# EAGLE schematic CH585M-R1 (EAGLE 9.6.2)
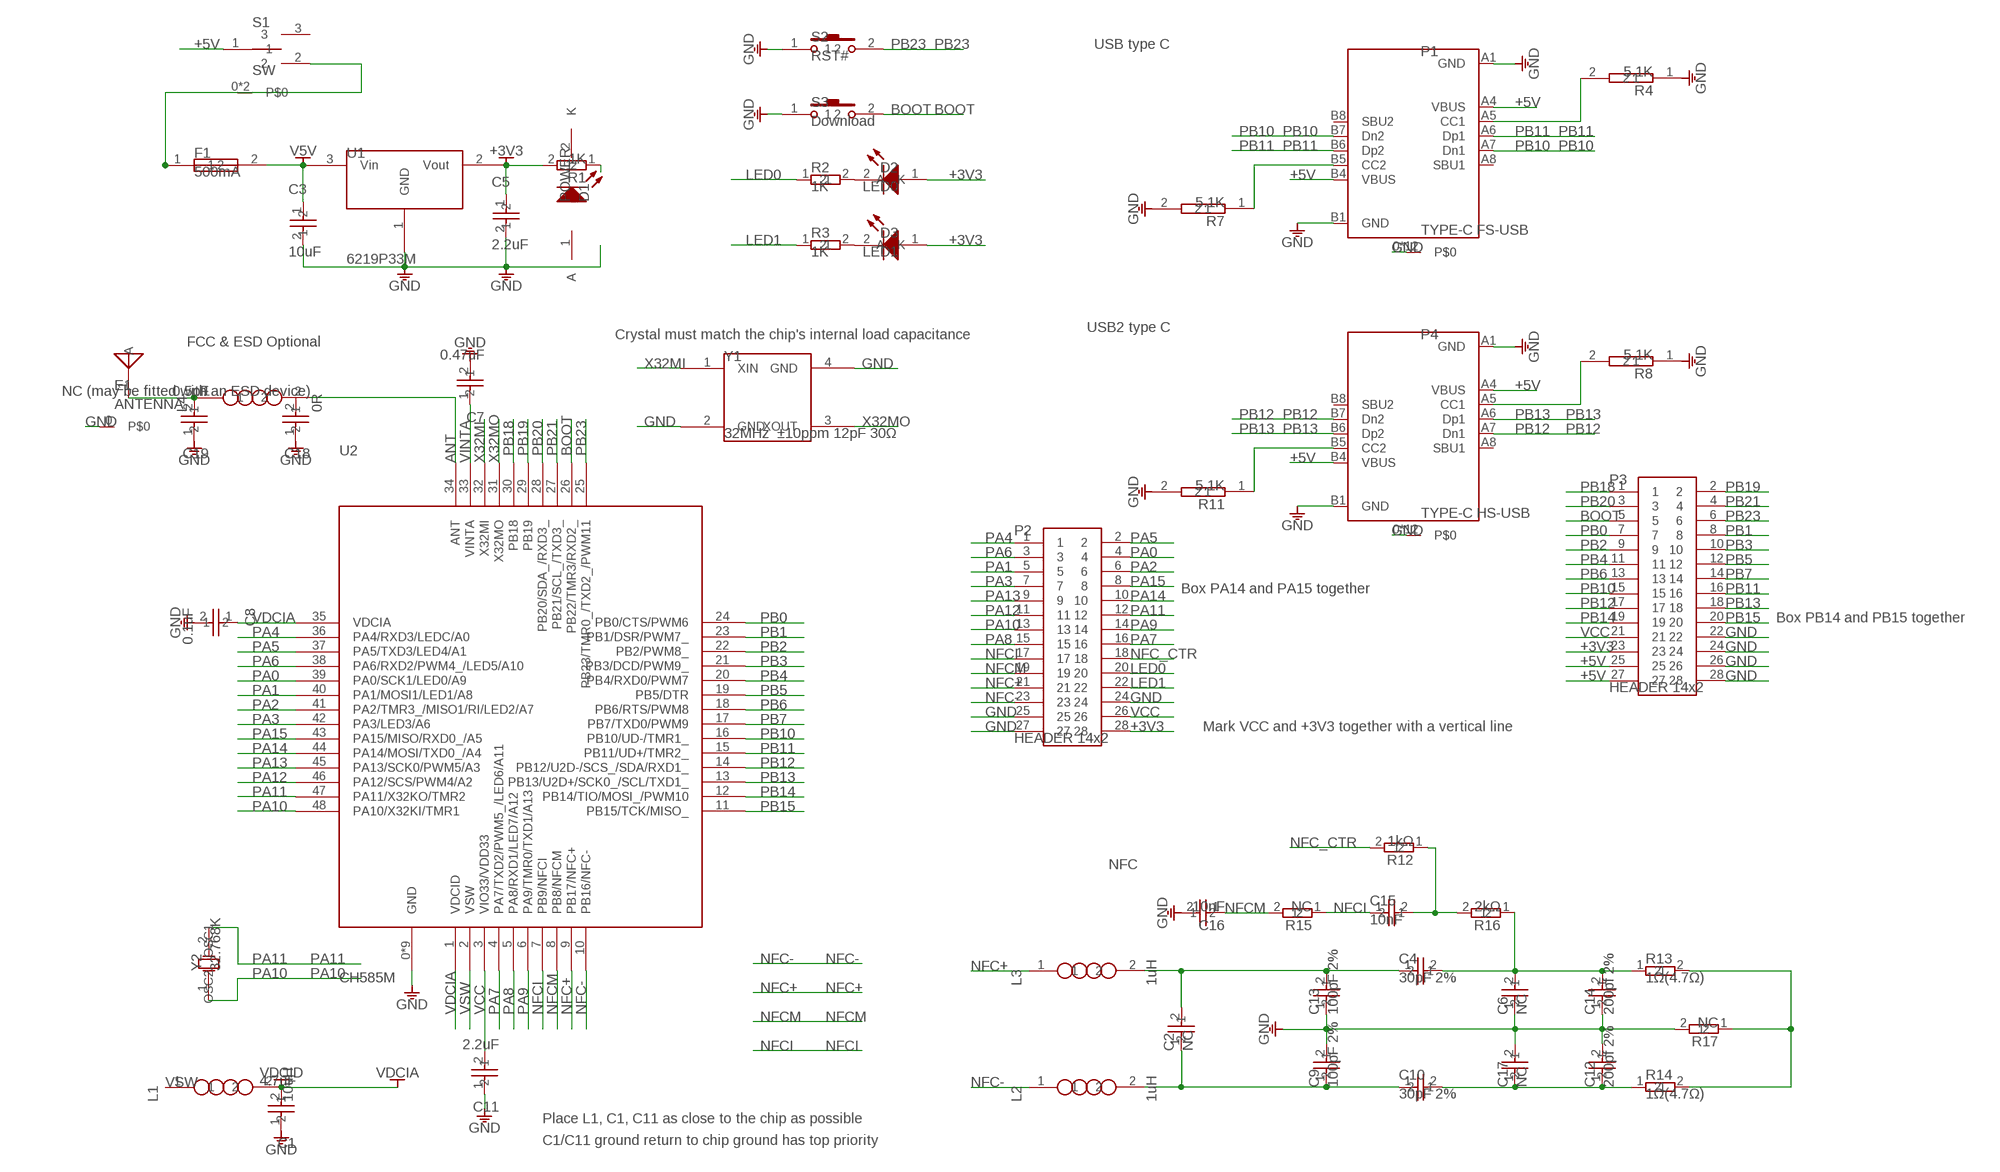
[diagram p0: schematic, sheet 1]

## Parts
C1  4.7uF  CAP-0402_C_8b34ab  [0402_C_8b34ab]
C2  NC  CAP_faf0ea-0402_C  [0402_C]
C3  10uF  CAP-0603_C  [0603_C]
C4  30pF 2%  CAP_faf0ea-0402_C_a5b067  [0402_C_a5b067]
C5  2.2uF  CAP-0402_C  [0402_C]
C6  NC  CAP_faf0ea-0402_C_a5b067  [0402_C_a5b067]
C7  0.47uF  CAP-0402_C  [0402_C]
C8  0.1uF  CAP-0402_C_ea6f3d  [0402_C_ea6f3d]
C9  100pF 2%  CAP_faf0ea-0402_C  [0402_C]
C10  30pF 2%  CAP_faf0ea-0402_C_a5b067  [0402_C_a5b067]
C11  2.2uF  CAP-0402_C_a5b067  [0402_C_a5b067]
C12  200pf 2%  CAP_faf0ea-0402_C_8b34ab  [0402_C_8b34ab]
C13  100pF 2%  CAP_faf0ea-0402_C  [0402_C]
C14  200pf 2%  CAP_faf0ea-0402_C_a5b067  [0402_C_a5b067]
C15  10nF  CAP_faf0ea-0402_C_a5b067  [0402_C_a5b067]
C16  10nF  CAP_faf0ea-0402_C_8b34ab  [0402_C_8b34ab]
C17  NC  CAP_faf0ea-0402_C_8b34ab  [0402_C_8b34ab]
C18  NC (may be fitted with an ESD device)  CAP-0402_C  [0402_C]
C19  0.5pF  CAP-0402_C  [0402_C]
D1  POWER  LED0-0603+  [0603+]
D2  LED0  LED0_27b5ee-0603+  [0603+]
D3  LED1  LED0_27b5ee-0603+  [0603+]
E1  ANTENNA  ANTENNA-ANT-F-1-2.4G-1.6mmFR4  [ANT-F-1-2.4G-1.6mmFR4]
F1  500mA  FUSE1-0603_8bd959  [0603_8bd959]
L1  10uH  INDUCTOR-SMD_2x2mm  [SMD_2x2mm]
L2  1uH  INDUCTOR-0603  [0603]
L3  1uH  INDUCTOR-0603  [0603]
L4  0R  INDUCTOR-SMD_2x2mm  [SMD_2x2mm]
P1  TYPE-C FS-USB  TYPE-C-Receptacle-2.0-TYPE-C-Receptacle-2.0  [TYPE-C-Receptacle-2.0]
P2  HEADER 14x2  HEADER14x2-IDC28-2.54MM  [IDC28-2.54MM]
P3  HEADER 14x2  HEADER14x2-IDC28-2.54MM  [IDC28-2.54MM]
P4  TYPE-C HS-USB  TYPE-C-Receptacle-2.0-TYPE-C-Receptacle-2.0  [TYPE-C-Receptacle-2.0]
R1  1K  RES-0402_b3dfe5  [0402_b3dfe5]
R2  1K  RES-0402_b3dfe5  [0402_b3dfe5]
R3  1K  RES-0402_b3dfe5  [0402_b3dfe5]
R4  5.1K  RES2-0402_b3dfe5  [0402_b3dfe5]
R7  5.1K  RES2-0402_b3dfe5  [0402_b3dfe5]
R8  5.1K  RES2-0402_b3dfe5  [0402_b3dfe5]
R11  5.1K  RES2-0402_b3dfe5  [0402_b3dfe5]
R12  1kΩ  RES_8d5796-0402_b3dfe5  [0402_b3dfe5]
R13  1Ω(4.7Ω)  RES_8d5796-0402_b3dfe5  [0402_b3dfe5]
R14  1Ω(4.7Ω)  RES_8d5796-0402_b3dfe5  [0402_b3dfe5]
R15  NC  RES_8d5796-0402_b3dfe5  [0402_b3dfe5]
R16  2kΩ  RES_8d5796-0402_b3dfe5  [0402_b3dfe5]
R17  NC  RES_8d5796-0402  [0402]
S1  SW  SW-SW1  [SW1]
S2  RST#  SW-PB-SMD_6.1x3.65x2.5mm-KEY  [SMD_6.1x3.65x2.5mm-KEY]
S3  Download  SW-PB-SMD_6.1x3.65x2.5mm-KEY  [SMD_6.1x3.65x2.5mm-KEY]
U1  6219P33M  6219P33M-SOT-23  [SOT-23]
U2  CH585M  CH585M-QFN48_5X5  [QFN48_5X5]
Y1  32MHz ±10ppm 12pF 30Ω  SYM-XT3225  [XT3225]
Y2  32.768K  XTAL-fc-135  [fc-135]

## Nets
+3V3: C5.1 D2.1(A) D3.1(A) P2.28 P3.23 R1.2 U1.2(Vout)
+5V: P1.A4(VBUS) P1.B4(VBUS) P3.25 P3.27 P4.A4(VBUS) P4.B4(VBUS) S1.1
ANT: C19.2 E1.1(A) L4.1 L4.2 U2.34(ANT)
BOOT: P3.5 S3.2 U2.26(PB22/TMR3/RXD2_)
GND: C1.1 C3.2 C5.2 C6.1 C7.2 C8.2 C9.2 C11.1 C12.2 C13.1 C14.1 C16.2 C17.2 C18.1 C19.1 D1.2(K) E1.0 P1.0 P1.0_2 P1.0_2B P1.0_2T P1.0_3 P1.0_3B P1.0_3T P1.0_4 P1.0_4B P1.0_4T P1.0B P1.0T P1.A1(GND) P1.B1(GND) P2.24 P2.25 P2.27 P3.22 P3.24 P3.26 P3.28 P4.0 P4.0_2 P4.0_2B P4.0_2T P4.0_3 P4.0_3B P4.0_3T P4.0_4 P4.0_4B P4.0_4T P4.0B P4.0T P4.A1(GND) P4.B1(GND) R4.1 R7.2 R8.1 R11.2 R17.2 S2.1 S3.1 U1.1(GND) U2.0(GND) U2.0_2(GND) U2.0_3(GND) U2.0_4(GND) U2.0_5(GND) U2.0_6(GND) U2.0_7(GND) U2.0_8(GND) U2.0_9(GND) Y1.2(GND) Y1.4(GND)
LED0: P2.20 R2.1
LED1: P2.22 R3.1
N$1: P4.A8(SBU1)
N$2: P4.B8(SBU2)
N$3: P1.B8(SBU2)
N$4: C18.2
N$5: P1.A8(SBU1)
N$6: S1.3
NetC2_1: C2.1 C9.1 C10.1 L2.2
NetC2_2: C2.2 C4.1 C13.2 L3.2
NetC4_2: C4.2 C6.2 C14.2 R13.1 R16.1
NetC10_2: C10.2 C12.1 C17.1 R14.1
NetC15_2: C15.2 R12.1 R16.2
NetD1_1: D1.1(A) R1.1
NetD2_2: D2.2(K) R2.2
NetD3_2: D3.2(K) R3.2
NetF1_1: F1.1 S1.2
NetP1_A5: P1.A5(CC1) R4.2
NetP1_B5: P1.B5(CC2) R7.1
NetP4_A5: P4.A5(CC1) R8.2
NetP4_B5: P4.B5(CC2) R11.1
NetR13_2: R13.2 R14.2 R17.1
NFC+: L3.1 P2.21 U2.9(PB17/NFC+)
NFC-: L2.1 P2.23 U2.10(PB16/NFC-)
NFC_CTR: P2.18 R12.2
NFCI: C15.1 P2.17 R15.1 U2.7(PB9/NFCI)
NFCM: C16.1 P2.19 R15.2 U2.8(PB8/NFCM)
PA0: P2.4 U2.39(PA0/SCK1/LED0/A9)
PA1: P2.5 U2.40(PA1/MOSI1/LED1/A8)
PA2: P2.6 U2.41(PA2/TMR3_/MISO1/RI/LED2/A7)
PA3: P2.7 U2.42(PA3/LED3/A6)
PA4: P2.1 U2.36(PA4/RXD3/LEDC/A0)
PA5: P2.2 U2.37(PA5/TXD3/LED4/A1)
PA6: P2.3 U2.38(PA6/RXD2/PWM4_/LED5/A10)
PA7: P2.16 U2.4(PA7/TXD2/PWM5_/LED6/A11)
PA8: P2.15 U2.5(PA8/RXD1/LED7/A12)
PA9: P2.14 U2.6(PA9/TMR0/TXD1/A13)
PA10: P2.13 U2.48(PA10/X32KI/TMR1) Y2.1(OSC1)
PA11: P2.12 U2.47(PA11/X32KO/TMR2) Y2.2(OSC2)
PA12: P2.11 U2.46(PA12/SCS/PWM4/A2)
PA13: P2.9 U2.45(PA13/SCK0/PWM5/A3)
PA14: P2.10 U2.44(PA14/MOSI/TXD0_/A4)
PA15: P2.8 U2.43(PA15/MISO/RXD0_/A5)
PB0: P3.7 U2.24(PB0/CTS/PWM6)
PB1: P3.8 U2.23(PB1/DSR/PWM7_)
PB2: P3.9 U2.22(PB2/PWM8_)
PB3: P3.10 U2.21(PB3/DCD/PWM9_)
PB4: P3.11 U2.20(PB4/RXD0/PWM7)
PB5: P3.12 U2.19(PB5/DTR)
PB6: P3.13 U2.18(PB6/RTS/PWM8)
PB7: P3.14 U2.17(PB7/TXD0/PWM9)
PB10: P1.A7(Dn1) P1.B7(Dn2) P3.15 U2.16(PB10/UD-/TMR1_)
PB11: P1.A6(Dp1) P1.B6(Dp2) P3.16 U2.15(PB11/UD+/TMR2_)
PB12: P3.17 P4.A7(Dn1) P4.B7(Dn2) U2.14(PB12/U2D-/SCS_/SDA/RXD1_)
PB13: P3.18 P4.A6(Dp1) P4.B6(Dp2) U2.13(PB13/U2D+/SCK0_/SCL/TXD1_)
PB14: P3.19 U2.12(PB14/TIO/MOSI_/PWM10)
PB15: P3.20 U2.11(PB15/TCK/MISO_)
PB18: P3.1 U2.30(PB18)
PB19: P3.2 U2.29(PB19)
PB20: P3.3 U2.28(PB20/SDA_/RXD3_)
PB21: P3.4 U2.27(PB21/SCL_/TXD3_)
PB23: P3.6 S2.2 U2.25(PB23/TMR0_/TXD2_/PWM11)
V5V: C3.1 F1.2 U1.3(Vin)
VCC: C11.2 P2.26 P3.21 U2.3(VIO33/VDD33)
VDCIA: C1.2 C8.1 L1.2 U2.1(VDCID) U2.35(VDCIA) ; supply symbol labelled VDCID
VINTA: C7.1 U2.33(VINTA)
VSW: L1.1 U2.2(VSW)
X32MI: U2.32(X32MI) Y1.1(XIN)
X32MO: U2.31(X32MO) Y1.3(XOUT)
Unconnected: S1.0 S1.0_2

## Notes on the sheet
- USB type C
- USB2 type C
- Crystal must match the chip's internal load capacitance
- FCC & ESD Optional
- Box PA14 and PA15 together
- Box PB14 and PB15 together
- Mark VCC and +3V3 together with a vertical line
- NFC
- Place L1, C1, C11 as close to the chip as possible
- C1/C11 ground return to chip ground has top priority

## Library data of the parts
C1 C3 C5 C7 C8 C11 C18 C19 = CH585M:CAP
C2 C4 C6 C9 C10 C12-C17 = CH585M:CAP_faf0ea
D1 = CH585M:LED0
D2 D3 = CH585M:LED0_27b5ee
E1 = CH585M:ANTENNA
F1 = CH585M:FUSE1
L1-L4 = CH585M:INDUCTOR
P1 P4 = CH585M:TYPE-C-Receptacle-2.0
P2 P3 = CH585M:HEADER14x2
R1-R3 = CH585M:RES
R4 R7 R8 R11 = CH585M:RES2
R12-R17 = CH585M:RES_8d5796
S1 = CH585M:SW
S2 S3 = CH585M:SW-PB
U1 = CH585M:6219P33M
U2 = CH585M:CH585M
Y1 = CH585M:SYM
Y2 = CH585M:XTAL